# Altium schematic sheet Cell Monitoring.SchDoc
size A; SheetNumber: 8; SheetTotal: 8
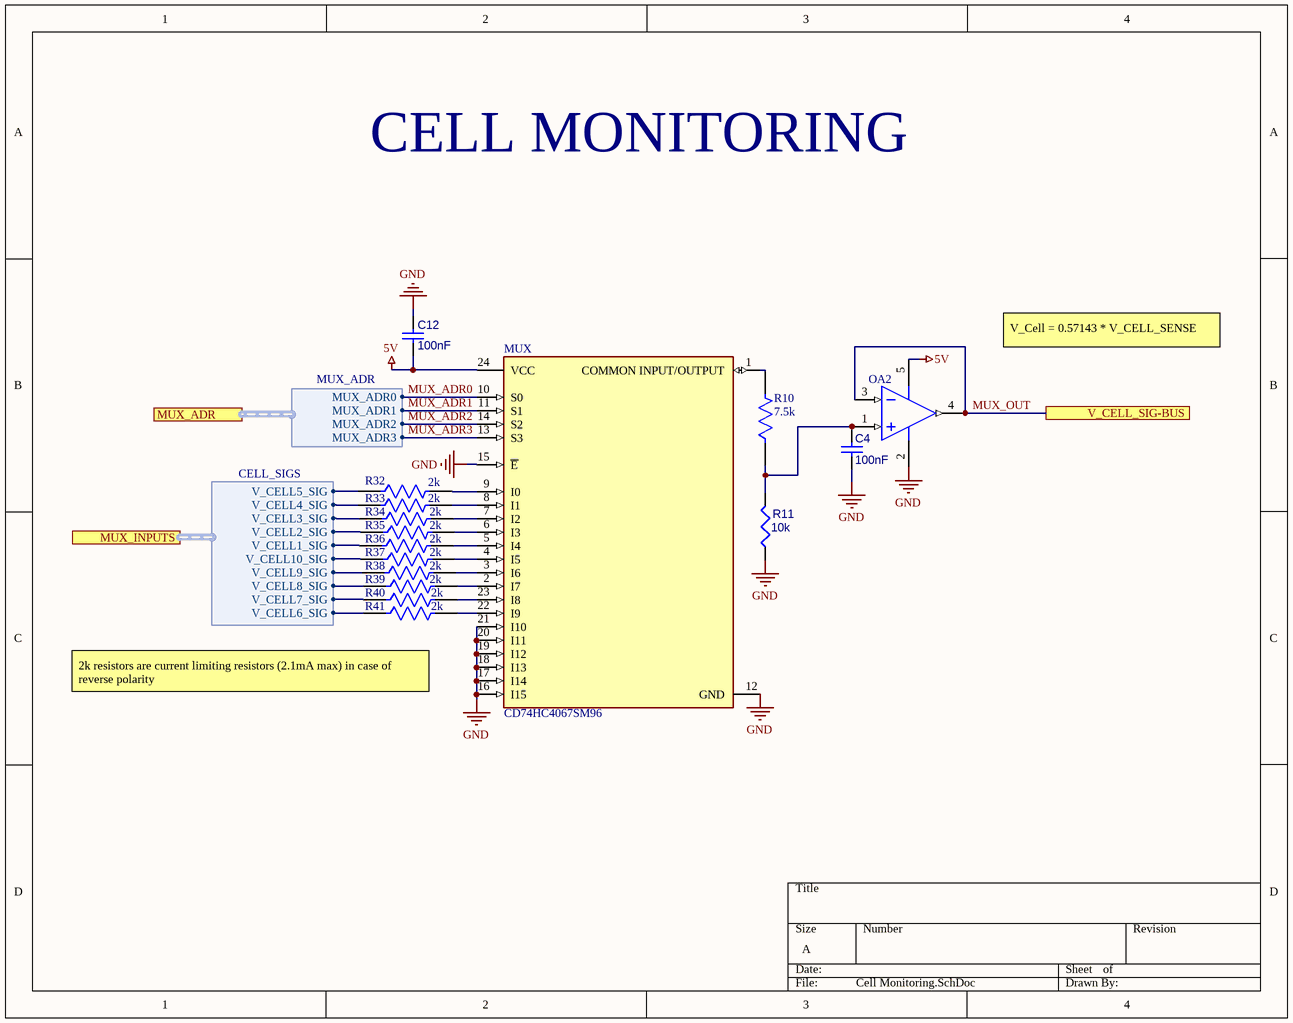
[diagram p0: Cell Monitoring.SchDoc]

## Parts
C4  100nF  [CAPC2013X95X50LL10T25]
C12  100nF  [CAPC2013X95X50LL10T25]
MUX  CD74HC4067SM96  [FP-DB0024A-IPC_C]
OA2  MCP6001UT-E/OT  [SOT-23-OT5_L]  (value not drawn)
R10  7.5k  [FP-CRCW0805-HPe3-IPC_B]
R11  10k  [RESC2013X50X35ML15T15]
R32  2k  [FP-TFCR0603-IPC_B]
R33  2k  [FP-TFCR0603-IPC_B]
R34  2k  [FP-TFCR0603-IPC_B]
R35  2k  [FP-TFCR0603-IPC_B]
R36  2k  [FP-TFCR0603-IPC_B]
R37  2k  [FP-TFCR0603-IPC_B]
R38  2k  [FP-TFCR0603-IPC_B]
R39  2k  [FP-TFCR0603-IPC_B]
R40  2k  [FP-TFCR0603-IPC_B]
R41  2k  [FP-TFCR0603-IPC_B]

## Ports
MUX_ADR (harness MUX_ADR), MUX_INPUTS (harness CELL_SIGS), V_CELL_SIG-BUS

## Harnesses
CELL_SIGS: V_CELL1_SIG, V_CELL2_SIG, V_CELL3_SIG, V_CELL4_SIG, V_CELL5_SIG, V_CELL6_SIG, V_CELL7_SIG, V_CELL8_SIG, V_CELL9_SIG, V_CELL10_SIG
MUX_ADR: MUX_ADR0, MUX_ADR1, MUX_ADR2, MUX_ADR3

## Nets
5V: C12.2 MUX.24(VCC) OA2.5(VDD)
GND: C4.2 C12.1 MUX.12(GND) MUX.15(~{E}) MUX.16(I15) MUX.17(I14) MUX.18(I13) MUX.19(I12) MUX.20(I11) MUX.21(I10) OA2.2(VSS) R11.1
MUX_ADR0: MUX.10(S0) ; port MUX_ADR.MUX_ADR0
MUX_ADR1: MUX.11(S1) ; port MUX_ADR.MUX_ADR1
MUX_ADR2: MUX.14(S2) ; port MUX_ADR.MUX_ADR2
MUX_ADR3: MUX.13(S3) ; port MUX_ADR.MUX_ADR3
MUX_OUT: OA2.3(VIN-) OA2.4(VOUT) ; port V_CELL_SIG-BUS
NetC4_1: C4.1 OA2.1(VIN+) R10.1 R11.2
NetMUX_1: MUX.1(COMMON_INPUT/OUTPUT) R10.2
NetMUX_2: MUX.2(I7) R39.2
NetMUX_3: MUX.3(I6) R38.2
NetMUX_4: MUX.4(I5) R37.2
NetMUX_5: MUX.5(I4) R36.2
NetMUX_6: MUX.6(I3) R35.2
NetMUX_7: MUX.7(I2) R34.2
NetMUX_8: MUX.8(I1) R33.2
NetMUX_9: MUX.9(I0) R32.2
NetMUX_22: MUX.22(I9) R41.2
NetMUX_23: MUX.23(I8) R40.2
NetR32_1: R32.1 ; port MUX_INPUTS.V_CELL5_SIG
NetR33_1: R33.1 ; port MUX_INPUTS.V_CELL4_SIG
NetR34_1: R34.1 ; port MUX_INPUTS.V_CELL3_SIG
NetR35_1: R35.1 ; port MUX_INPUTS.V_CELL2_SIG
NetR36_1: R36.1 ; port MUX_INPUTS.V_CELL1_SIG
NetR37_1: R37.1 ; port MUX_INPUTS.V_CELL10_SIG
NetR38_1: R38.1 ; port MUX_INPUTS.V_CELL9_SIG
NetR39_1: R39.1 ; port MUX_INPUTS.V_CELL8_SIG
NetR40_1: R40.1 ; port MUX_INPUTS.V_CELL7_SIG
NetR41_1: R41.1 ; port MUX_INPUTS.V_CELL6_SIG

## Notes on the sheet
- CELL MONITORING
- V_Cell = 0.57143 * V_CELL_SENSE
- 2k resistors are current limiting resistors (2.1mA max) in case of reverse polarity

## Library data of the parts
C4 C12 = CMP-001-00018-6: Capacitor 100 nF +/-10% 50 V 0805; Voltage Rating: 50V; Tolerance: 10%; Capacitor Type: Ceramic; Value: 100nF; Pins: 2; Max Operating Temperature: 125°C; Min Operating Temperature: -55°C; Mounting Technology: SM; Case/Package: 0805; RoHS Compliant: True
MUX = CMP-04892-000038-1: IC MUX/DEMUX 1X16 24SSOP; Supply Type: Single; High Level Output Current: 25mA; Min Supply Voltage: 2V; Number of Circuits: 16; Max Supply Voltage: 6V; Number of Channels: 1; Turn-On Delay Time: 300ns; Max Supply Current: 8uA; Bandwidth: 89MHz; Turn-Off Delay Time: 290ns; Propagation Delay: 75ns; Logic Function: Multiplexer; On-State Resistance: 160R; Polarity: Non-Inverting; Width: 5.3mm; Case/Package: SSOP; Max Operating Temperature: 125°C; Mount: Surface Mount; Min Operating Temperature: -55°C; REACH SVHC: No SVHC; Contact Plating: Gold; Max Output Current: 25mA; Weight: 0.006081oz; Height: 1.95mm; Package Quantity: 2000; Length: 8.2mm; Lead Free: Lead Free; Operating Supply Current: 8uA; Packaging: Tape and Reel; Series: 74HC; Low Level Output Current: 25mA; Number of Outputs: 1; Termination: SMD/SMT; Number of Inputs: 16; Number of Bits: 16; Radiation Hardening: No; Number of Pins: 24
OA2 = CMP-0187-00480-3: None; Number of Channels: 1; Max Supply Voltage: 6V; Slew Rate: 0.6V/µs; Common Mode Rejection Ratio: 60dB; Gain Bandwidth Product: 1MHz; Amplifier Type: GENERAL PURPOSE; Power Supply Rejection Ratio (PSRR): 86dB; Supply Current: 100uA; Voltage Gain: 112dB; Input Bias Current: 1pA; Output Current: 23mA; Min Supply Voltage: 1.8V; Operating Supply Voltage: 5.5V; Input Offset Voltage-Max: 4.5mV; REACH SVHC: No SVHC; Number of Amplifiers: 1; Max Operating Temperature: 125°C; RoHS Compliant: Yes; Min Operating Temperature: -40°C; Number of Elements: 1; Slew Rate-Nom: 0.6V/µs; Mount: Surface Mount; Package Quantity: 3000; Number of Circuits: 1; Lead Free: Lead Free; Height: 1.3mm; Number of Pins: 5; Nominal Supply Current: 100uA; Radiation Hardening: No; Length: 3.1mm; Width: 1.8mm; Packaging: Tape and Reel; Unity Gain Bandwidth Product: 1MHz; Case/Package: SOT-23; Bandwidth: 1MHz; Input Offset Voltage (Vos): 4.5mV; Technology: CMOS
R10 = CMP-02407-001990-1: CRCW08057K50FKEAHP RES Thick Film, 7.5kΩ, 1%, 0.5W, 100ppm/°C, 0805; Resistance: 7.5kR; Max Power Dissipation: 500mW; Height: 0.024inch; Max Operating Temperature: 155°C; Tolerance: 1%; Case/Package: 0805; Lead Free: Lead Free; Min Operating Temperature: -55°C; Military Standard: Not; Length: 0.079inch; Temperature Coefficient: 100ppm/°C; Package Quantity: 5000; Depth: 1.25mm; Width: 0.049inch; Packaging: Tape and Reel; Composition: Thick Film; Features: Automotive AEC-Q200; Number of Terminations: 2; Contact Plating: Tin
R11 = CMP-009-00018-5: Chip Resistor, 10 KOhm, +/- 1%, 125 mW, -55 to 155 degC, 0805 (2012 Metric); Power: 125mW; Voltage Rating: 150V; Tolerance: 1%; Pins: 2; Min Operating Temperature: -55°C; Case/Package: 0805; Max Operating Temperature: 155°C; RoHS Compliant: True; Mounting Technology: SM
R32-R41 = CMP-250906-173560-1: TFCR0603-10W-E-2001BT